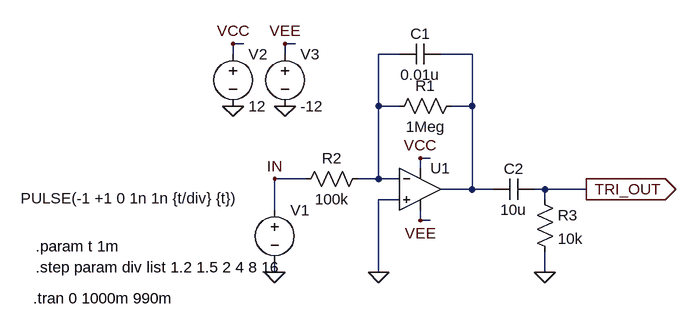
[diagram p0: schematic SQR_to_TRI_02.asc]
SQR_to_TRI_02.asc, the LTspice schematic file:
Version 4
SHEET 1 880 680
WIRE 32 -192 16 -192
WIRE 112 -192 96 -192
WIRE 16 -176 16 -192
WIRE 96 -176 96 -192
WIRE 272 -176 240 -176
WIRE 384 -176 336 -176
WIRE 240 -96 240 -176
WIRE 272 -96 240 -96
WIRE 384 -96 384 -176
WIRE 384 -96 352 -96
WIRE 320 -16 304 -16
WIRE 304 0 304 -16
WIRE 128 16 80 16
WIRE 240 16 240 -96
WIRE 240 16 208 16
WIRE 272 16 240 16
WIRE 384 32 384 -96
WIRE 384 32 336 32
WIRE 416 32 384 32
WIRE 496 32 480 32
WIRE 560 32 496 32
WIRE 272 48 240 48
WIRE 496 48 496 32
WIRE 80 64 80 16
WIRE 304 80 304 64
WIRE 320 80 304 80
WIRE 80 160 80 144
WIRE 240 160 240 48
WIRE 496 160 496 128
FLAG 80 160 0
FLAG 304 -16 VCC
FLAG 304 80 VEE
FLAG 560 32 TRI_OUT
IOPIN 560 32 Out
FLAG 16 -96 0
FLAG 96 -96 0
FLAG 16 -192 VCC
FLAG 96 -192 VEE
FLAG 240 160 0
FLAG 80 16 IN
FLAG 496 160 0
SYMBOL voltage 80 48 R0
WINDOW 3 -391 -2 Left 2
WINDOW 123 0 0 Left 2
WINDOW 39 0 0 Left 2
SYMATTR InstName V1
SYMATTR Value PULSE(-1 +1 0 1n 1n {t/div} {t})
SYMBOL Opamps\\UniversalOpamp2 304 32 R0
SYMATTR InstName U1
SYMBOL res 368 -112 R90
WINDOW 0 0 56 VBottom 2
WINDOW 3 32 56 VTop 2
SYMATTR InstName R1
SYMATTR Value 1Meg
SYMBOL cap 336 -192 R90
WINDOW 0 0 32 VBottom 2
WINDOW 3 32 32 VTop 2
SYMATTR InstName C1
SYMATTR Value 0.01u
SYMBOL res 224 0 R90
WINDOW 0 0 56 VBottom 2
WINDOW 3 32 56 VTop 2
SYMATTR InstName R2
SYMATTR Value 100k
SYMBOL voltage 16 -192 R0
WINDOW 123 0 0 Left 2
WINDOW 39 0 0 Left 2
SYMATTR InstName V2
SYMATTR Value 12
SYMBOL voltage 96 -192 R0
WINDOW 123 0 0 Left 2
WINDOW 39 0 0 Left 2
SYMATTR InstName V3
SYMATTR Value -12
SYMBOL cap 480 16 R90
WINDOW 0 0 32 VBottom 2
WINDOW 3 32 32 VTop 2
SYMATTR InstName C2
SYMATTR Value 10u
SYMBOL res 480 32 R0
SYMATTR InstName R3
SYMATTR Value 10k
TEXT -292 200 Left 2 !.tran 0 1000m 990m
TEXT -288 120 Left 2 !.param t 1m
TEXT -288 152 Left 2 !.step param div list 1.2 1.5 2 4 8 16

The netlist it stands for:
* SQR_to_TRI_02.asc
V1 IN 0 PULSE(-1 +1 0 1n 1n {t/div} {t})
XU1 0 N001 VCC VEE N002 level.2 Avol=1Meg GBW=10Meg Slew=10Meg ilimit=25m rail=0 Vos=0 phimargin=45 en=0 enk=0 in=0 ink=0 Rin=500Meg  ; pins IN+ IN- V+ V- OUT
R1 N002 N001 1Meg
C1 N002 N001 0.01u
R2 N001 IN 100k
V2 VCC 0 12
V3 VEE 0 -12
C2 TRI_OUT N002 10u
R3 TRI_OUT 0 10k
.tran 0 1000m 990m
.param t 1m
.step param div list 1.2 1.5 2 4 8 16
.lib UniversalOpamps2.sub
.backanno
.end